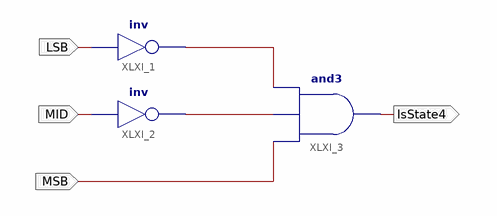
[diagram p0: schematic sheet 1]
// Xilinx ISE schematic IsState4.sch (spartan6) as structural Verilog: 3 symbols, 4 ports
module IsState4 (
  input  LSB,
  input  MID,
  input  MSB,
  output IsState4
);

  wire XLXN_3, XLXN_4;

  not XLXI_1 (XLXN_3, LSB);
  not XLXI_2 (XLXN_4, MID);
  and XLXI_3 (IsState4, MSB, XLXN_4, XLXN_3);
endmodule
